# EAGLE board SparkFun RTK Facet - Main (EAGLE 9.6.2)
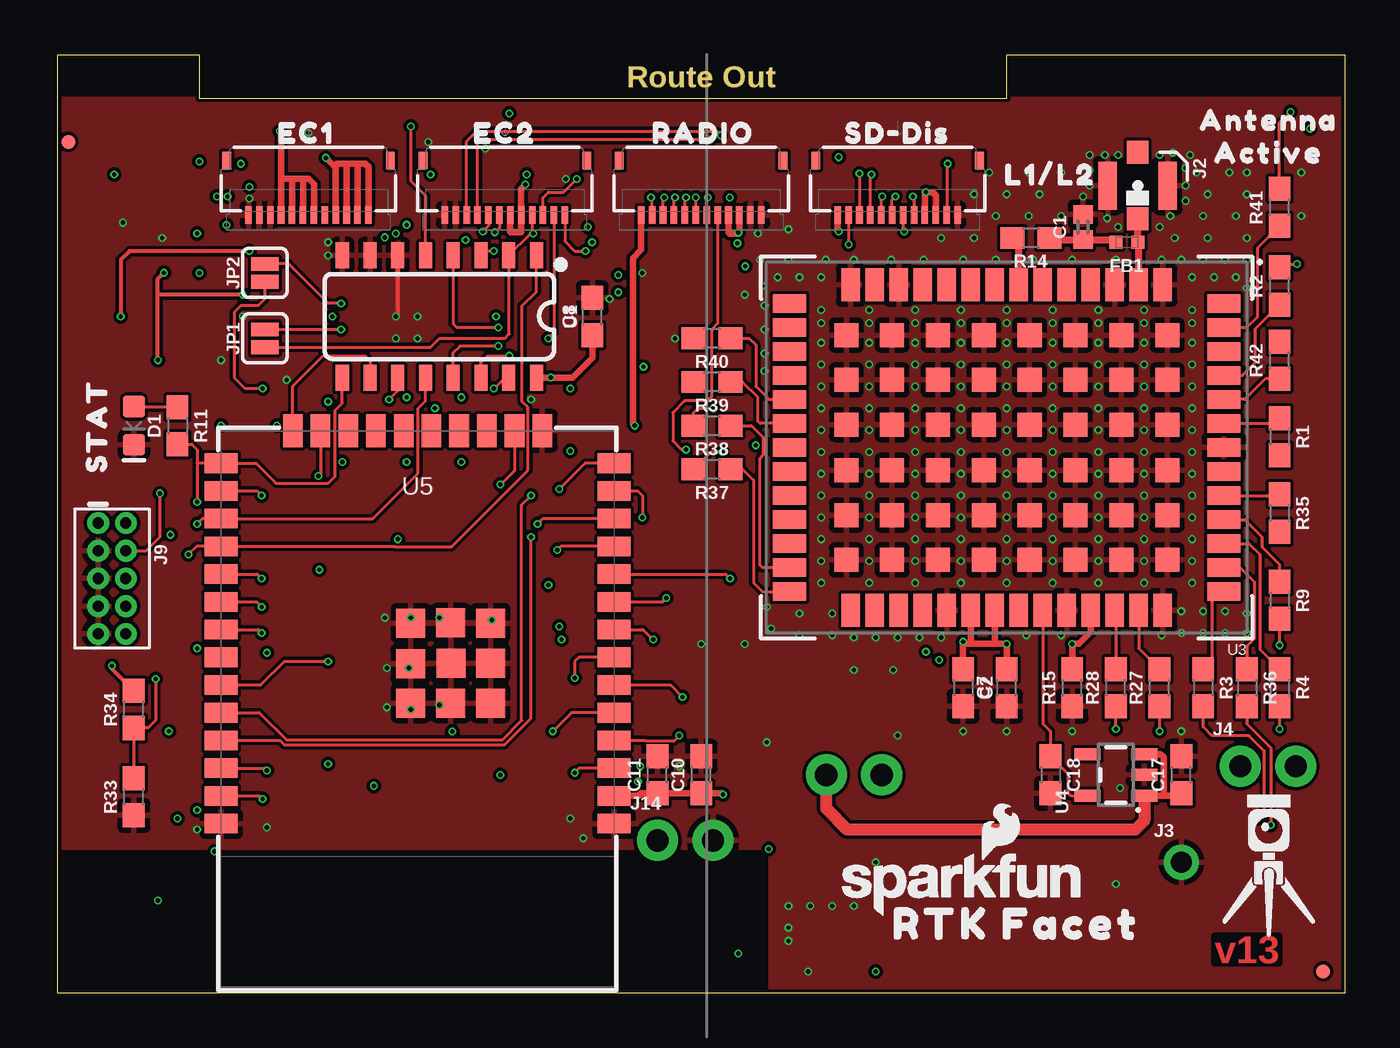
[diagram p2: board, top side]
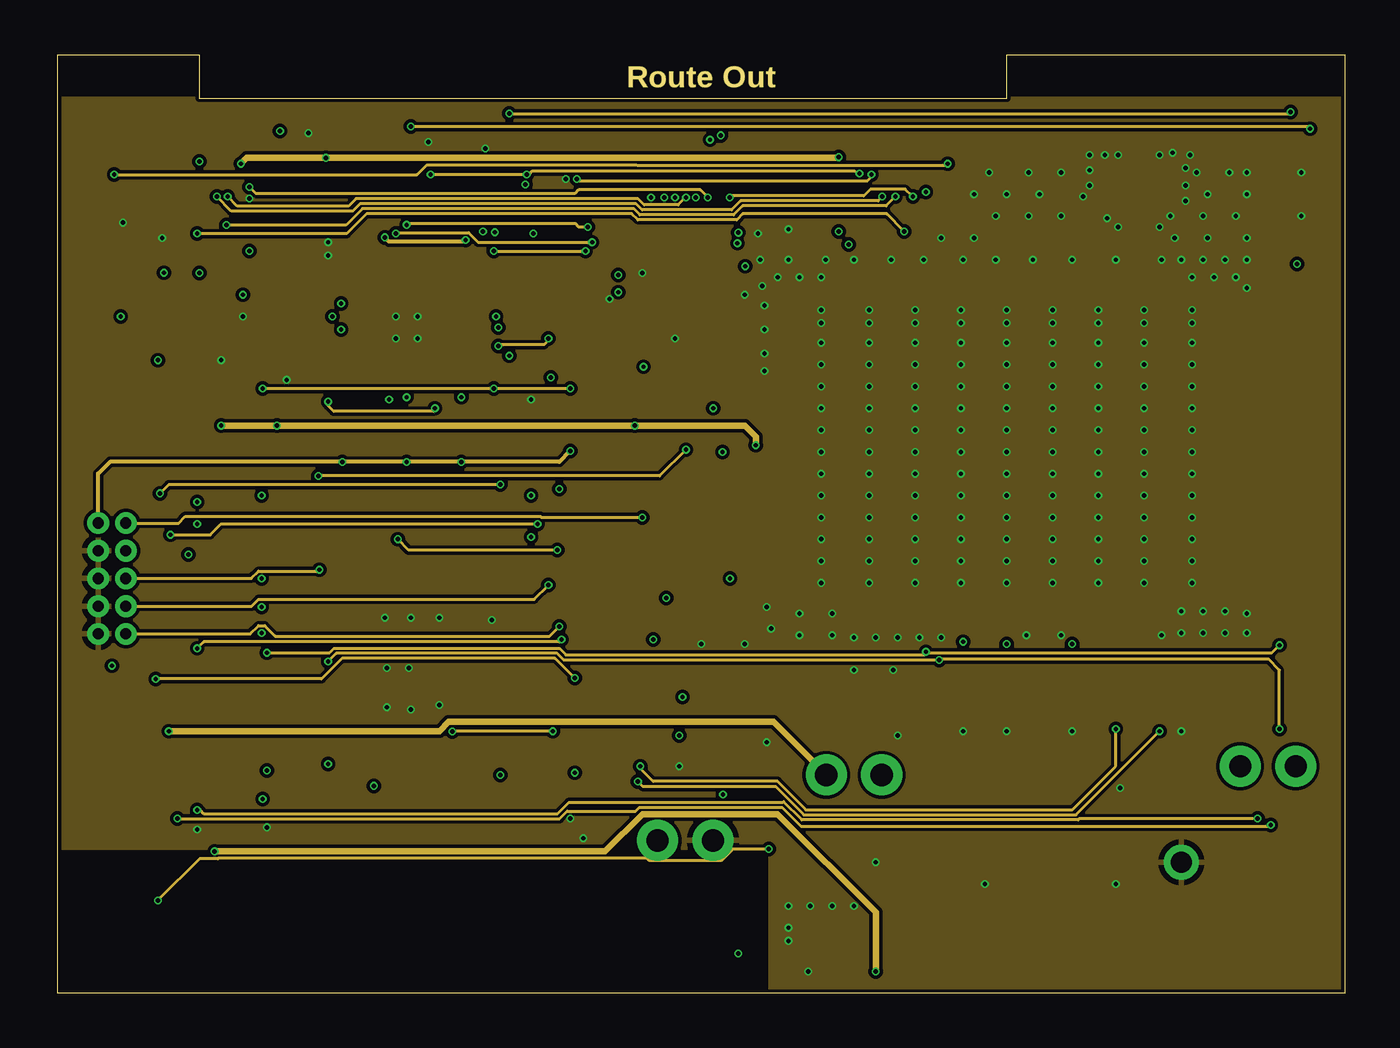
[diagram p3: board, inner layer GND/Horz]
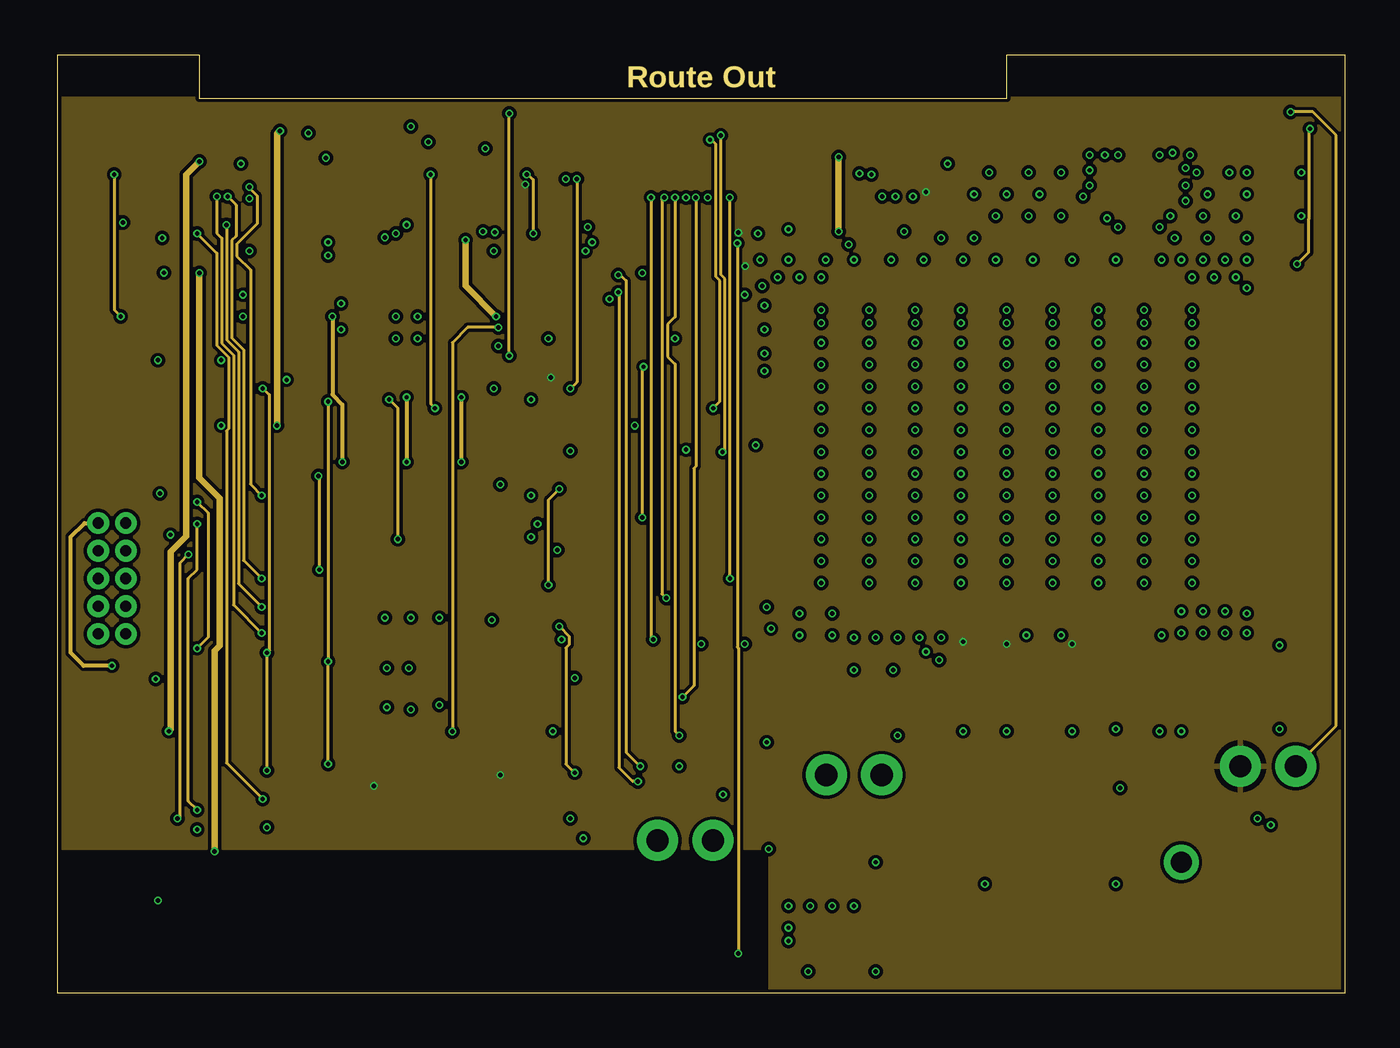
[diagram p4: board, inner layer 3.3V/Vert]
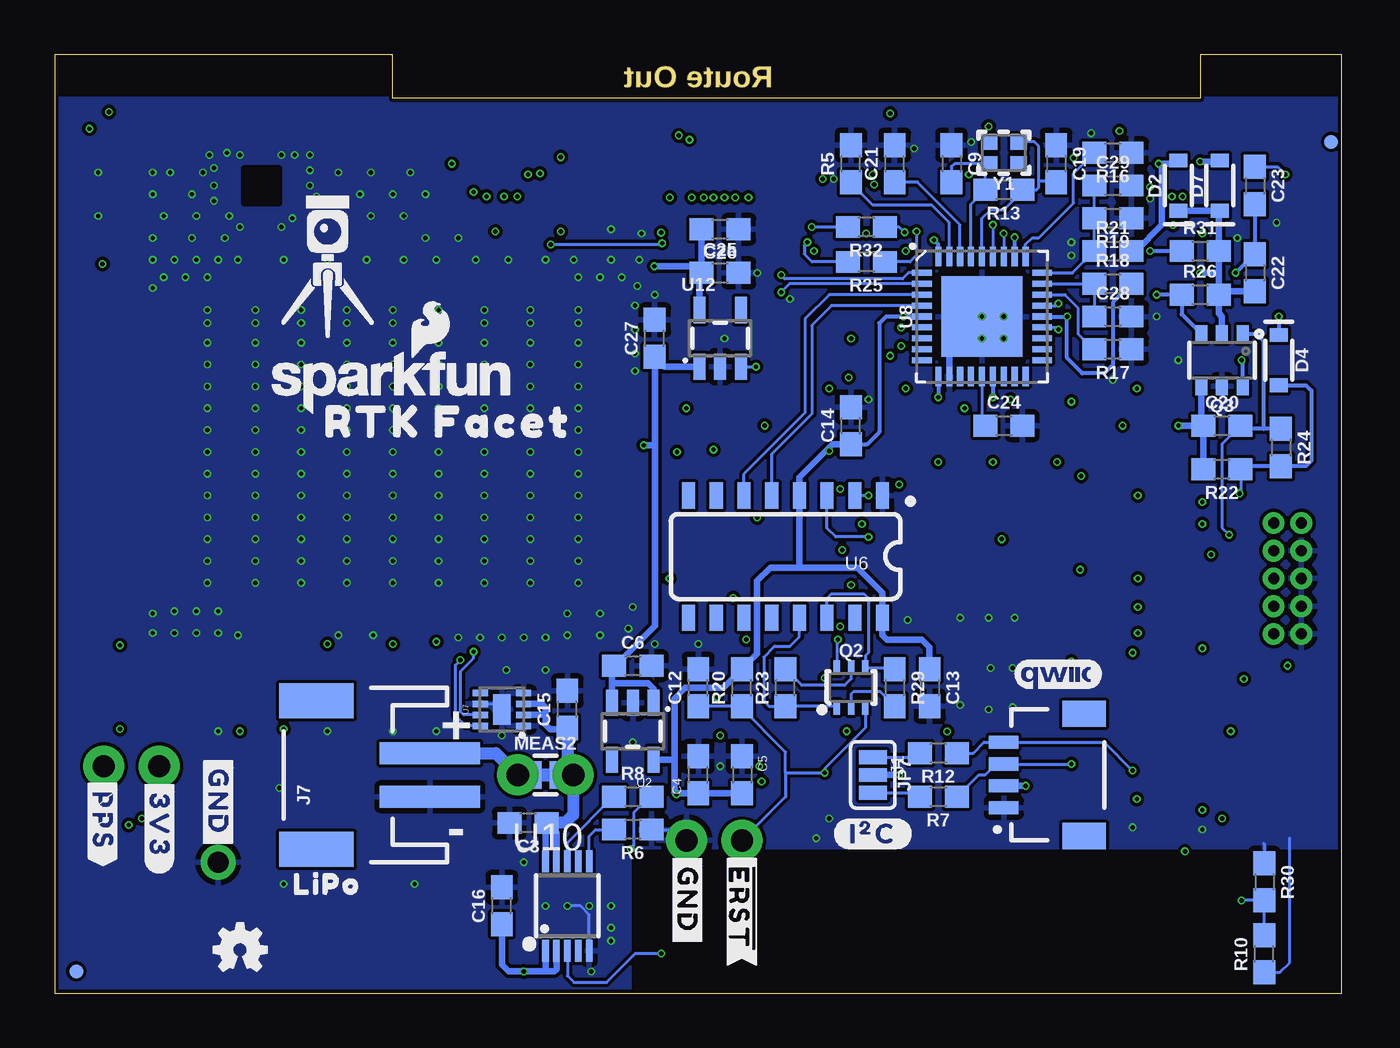
[diagram p5: board, bottom side, seen from below]

Size 59 x 43 mm. Coordinates in mm from the lower left corner, seen from the top.
Outline: 59,43 59,0 0,0 0,43 6.5,43 6.5,41 43.5,41 43.5,43 59,43
Copper layers (1+2*15+16): Top/Horz 0.035mm / dielectric 1.5mm / GND/Horz 0.035mm / dielectric 0.15mm / 3.3V/Vert 0.035mm / dielectric 0.2mm / Bottom/Vert 0.035mm
Design rules "SparkFun-4-Layer-MicroMod-JLCPCB": minimum track width 4mil, minimum drill 0.2mm, track to track 4mil, track to pad 4mil, pad to pad 4mil, via to via 4mil, smd to smd 4mil, copper to edge 6mil, drill to drill 6mil, minimum pad ring 3mil, minimum via ring 3mil, stop-mask expansion 4mil, vias tented up to drill 25mil, thermal gap 10mil
Net classes: 0 default: width 0 mm, drill 0 mm; 1 power: width 0.178 mm; 2 3.3V: width 0.559 mm; 3 RF: width 0.33 mm, clearance 0.203 mm
tKeepout: area 0,0 to 2,43; area 57,0 to 59,43
bKeepout: area 0,0 to 2,43; area 57,0 to 59,43
tRestrict: area 8.9,35.5 to 9.1,35.8; area 9.4,35.5 to 9.6,35.8; area 17.9,35.5 to 18.1,35.8; area 31.9,35.5 to 32.1,35.8; area 9.9,35.5 to 10,35.8; area 18.4,35.5 to 18.6,35.8; area 31.5,35.5 to 31.6,35.8

## Footprints (pad centres in the part's own frame; a part is rotated, then mirrored left to right if it is on the bottom)
0402 = smd 0.85 x 0.9: 1 -0.58,0; 2 0.58,0
0603 = smd 1.1 x 1: 1 -0.85,0; 2 0.85,0
LED-0603 = smd 1 x 1: A -0.877,0; C 0.877,0
SOD-323 = smd 0.63 x 0.83: A 1.15,0; C -1.15,0
0402-TIGHT = smd 0.6 x 0.6: 1 -0.5,0; 2 0.5,0
JST04_1MM_RA = smd 0.6 x 1.35: 1 -1.5,0; 2 -0.5,0; 3 0.5,0; 4 1.5,0 | smd 1.2 x 2: NC1 2.8,-3.675; NC2 -2.8,-3.675
U.FL = smd 2.2 x 0.85: 1 0,1.375; 2 0,-1.375 | smd 1.05 x 1: FEED 1.525,0; NC -1.525,0
1X01_NO_SILK = drill 0.95 pad 1.6: 1 0,0
1X02_NO_SILK = drill 1.016 pad 1.88: 1 0,0; 2 2.54,0
JST-2-SMD = smd 1 x 4.6: 1 -1,-3.7; 2 1,-3.7 | smd 1.6 x 3.4: NC1 -3.4,1.5; NC2 3.4,1.5
FPC_12_DOUBLESIDED_BACKFLIP = smd 0.3 x 0.8: 1 -2.75,1.35; 2 -2.25,1.35; 3 -1.75,1.35; 4 -1.25,1.35; 5 -0.75,1.35; 6 -0.25,1.35; 7 0.25,1.35; 8 0.75,1.35; 9 1.25,1.35; 10 1.75,1.35; 11 2.25,1.35; 12 2.75,1.35 | smd 0.4 x 0.8: MP1 -3.75,-1.15; MP2 3.75,-1.15
2X5-PTH-1.27MM = drill 0.508 pad 1: 1 -2.54,-0.635; 2 -2.54,0.635; 3 -1.27,-0.635; 4 -1.27,0.635; 5 0,-0.635; 6 0,0.635; 7 1.27,-0.635; 8 1.27,0.635; 9 2.54,-0.635; 10 2.54,0.635
SMT-JUMPER_2_NO_SILK = smd 0.635 x 1.27: 1 -0.406,0; 2 0.406,0
SMT-JUMPER_3_NO_SILK = smd 0.635 x 1.27: 1 -0.813,0; 2 0,0; 3 0.813,0
FIDUCIAL-MICRO = smd 0.635 x 0.635: 1 0,0
COMBO-JUMPER_2_NC_TRACE = smd 0.635 x 1.27: 1 -0.508,0; 2 0.508,0 | drill 1.016 pad 1.88: 3 -1.27,0; 4 1.27,0
SC70-6 = smd 0.3 x 0.66: 1 -0.65,-0.92; 2 0,-0.92; 3 0.65,-0.92; 4 0.65,0.92; 5 0,0.92; 6 -0.65,0.92
SOT26 = smd 0.55 x 0.8: D1 -0.95,1.2; D2 0.95,1.2; G1 -0.95,-1.2; G2 0.95,-1.2; S1 0,1.2; S2 0,-1.2
SO16 = smd 0.6 x 1.2: 1 -4.445,-2.8; 2 -3.175,-2.8; 3 -1.905,-2.8; 4 -0.635,-2.8; 5 0.635,-2.8; 6 1.905,-2.8; 7 3.175,-2.8; 8 4.445,-2.8; 9 4.445,2.8; 10 3.175,2.8; 11 1.905,2.8; 12 0.635,2.8; 13 -0.635,2.8; 14 -1.905,2.8; 15 -3.175,2.8; 16 -4.445,2.8
SOT23-5 = smd 0.55 x 1.2: 1 -0.95,-1.3; 2 0,-1.3; 3 0.95,-1.3; 4 0.95,1.3; 5 -0.95,1.3
ZED-F9P = smd 0.85 x 1.52: 1 -7.15,-7.45; 2 -6.05,-7.45; 3 -4.95,-7.45; 4 -3.85,-7.45; 5 -2.75,-7.45; 6 -1.65,-7.45; 7 -0.55,-7.45; 8 0.55,-7.45; 9 1.65,-7.45; 10 2.75,-7.45; 11 3.85,-7.45; 12 4.95,-7.45; 13 6.05,-7.45; 14 7.15,-7.45; 28 7.15,7.45; 29 6.05,7.45; 30 4.95,7.45; 31 3.85,7.45; 32 2.75,7.45; 33 1.65,7.45; 34 0.55,7.45; 35 -0.55,7.45; 36 -1.65,7.45; 37 -2.75,7.45; 38 -3.85,7.45; 39 -4.95,7.45; 40 -6.05,7.45; 41 -7.15,7.45 | smd 1.52 x 0.85: 15 9.95,-6.6; 16 9.95,-5.5; 17 9.95,-4.4; 18 9.95,-3.3; 19 9.95,-2.2; 20 9.95,-1.1; 21 9.95,0; 22 9.95,1.1; 23 9.95,2.2; 24 9.95,3.3; 25 9.95,4.4; 26 9.95,5.5; 27 9.95,6.6; 42 -9.95,6.6; 43 -9.95,5.5; 44 -9.95,4.4; 45 -9.95,3.3; 46 -9.95,2.2; 47 -9.95,1.1; 48 -9.95,0; 49 -9.95,-1.1; 50 -9.95,-2.2; 51 -9.95,-3.3; 52 -9.95,-4.4; 53 -9.95,-5.5; 54 -9.95,-6.6 | smd 1.1 x 1.1: 55 -1.05,-1.05; 56 -3.15,-1.05; 57 -5.25,-1.05; 58 -7.35,-1.05; 59 -1.05,-3.1; 60 -3.15,-3.1; 61 -5.25,-3.1; 62 -7.35,-3.1; 63 -1.05,-5.15; 64 -3.15,-5.15; 65 -5.25,-5.15; 66 -7.35,-5.15; 67 -1.05,5.15; 68 -3.15,5.15; 69 -5.25,5.15; 70 -7.35,5.15; 71 -1.05,3.1; 72 -3.15,3.1; 73 -5.25,3.1; 74 -7.35,3.1; 75 -1.05,1.05; 76 -3.15,1.05; 77 -5.25,1.05; 78 -7.35,1.05; 79 1.05,1.05; 80 3.15,1.05; 81 5.25,1.05; 82 7.35,1.05; 83 1.05,3.1; 84 3.15,3.1; 85 5.25,3.1; 86 7.35,3.1; 87 1.05,5.15; 88 3.15,5.15; 89 5.25,5.15; 90 7.35,5.15; 91 1.05,-5.15; 92 3.15,-5.15; 93 5.25,-5.15; 94 7.35,-5.15; 95 1.05,-3.1; 96 3.15,-3.1; 97 5.25,-3.1; 98 7.35,-3.1; 99 1.05,-1.05; 100 3.15,-1.05; 101 5.25,-1.05; 102 7.35,-1.05
ESP-WROOM-32D-DFM_PASTE = smd 0.9 x 1.5: 1 6.43,9; 2 5.16,9; 3 3.89,9; 4 2.62,9; 5 1.35,9; 6 0.08,9; 7 -1.19,9; 8 -2.46,9; 9 -3.73,9; 10 -5,9; 11 -6.27,9; 12 -7.54,9; 13 -8.81,9; 14 -10.08,9; 25 -10.08,-9; 26 -8.81,-9; 27 -7.54,-9; 28 -6.27,-9; 29 -5,-9; 30 -3.73,-9; 31 -2.46,-9; 32 -1.19,-9; 33 0.08,-9; 34 1.35,-9; 35 2.62,-9; 36 3.89,-9; 37 5.16,-9; 38 6.43,-9 | smd 1.5 x 0.9: 15 -11.57,5.715; 16 -11.57,4.445; 17 -11.57,3.175; 18 -11.57,1.905; 19 -11.57,0.635; 20 -11.57,-0.635; 21 -11.57,-1.905; 22 -11.57,-3.175; 23 -11.57,-4.445; 24 -11.57,-5.715 | smd 1.33 x 1.33: GND -0.912,1.531; GNDT1 -2.751,3.346; GNDT2 -2.761,1.516; GNDT3 -2.751,-0.314; GNDT4 -0.891,-0.324; GNDT5 0.909,-0.314; GNDT6 0.909,1.516; GNDT7 0.909,3.346; GNDT8 -0.921,3.346
SO016 = smd 0.6 x 1.2: 1 -4.445,-2.8; 2 -3.175,-2.8; 3 -1.905,-2.8; 4 -0.635,-2.8; 5 0.635,-2.8; 6 1.905,-2.8; 7 3.175,-2.8; 8 4.445,-2.8; 9 4.445,2.8; 10 3.175,2.8; 11 1.905,2.8; 12 0.635,2.8; 13 -0.635,2.8; 14 -1.905,2.8; 15 -3.175,2.8; 16 -4.445,2.8
DFN-8 = smd 0.3 x 0.7: 1 -0.75,-0.99; 2 -0.25,-0.99; 3 0.25,-0.99; 4 0.75,-0.99; 5 0.75,0.99; 6 0.25,0.99; 7 -0.25,0.99; 8 -0.75,0.99 | smd 1.38 x 0.8: 9 0,0
QFN-36 = smd 0.9 x 0.28: 1 -2.75,2; 2 -2.75,1.5; 3 -2.75,1; 4 -2.75,0.5; 5 -2.75,0; 6 -2.75,-0.5; 7 -2.75,-1; 8 -2.75,-1.5; 9 -2.75,-2; 19 2.75,-2; 20 2.75,-1.5; 21 2.75,-1; 22 2.75,-0.5; 23 2.75,0; 24 2.75,0.5; 25 2.75,1; 26 2.75,1.5; 27 2.75,2 | smd 0.28 x 0.9: 10 -2,-2.75; 11 -1.5,-2.75; 12 -1,-2.75; 13 -0.5,-2.75; 14 0,-2.75; 15 0.5,-2.75; 16 1,-2.75; 17 1.5,-2.75; 18 2,-2.75; 28 2,2.75; 29 1.5,2.75; 30 1,2.75; 31 0.5,2.75; 32 0,2.75; 33 -0.5,2.75; 34 -1,2.75; 35 -1.5,2.75; 36 -2,2.75 | smd 3.7 x 3.7: EP 0,0
MSOP10 = smd 0.3 x 1: 1 -1,-2.05; 2 -0.5,-2.05; 3 0,-2.05; 4 0.5,-2.05; 5 1,-2.05; 6 1,2.05; 7 0.5,2.05; 8 0,2.05; 9 -0.5,2.05; 10 -1,2.05
CRYSTAL-SMD-2.0X1.6MM = smd 0.75 x 0.7: 1 -0.675,-0.5; 2 0.675,-0.5; 3 0.675,0.5; 4 -0.675,0.5

## Placement (x,y rotation side)
C1  47pF  [0402]  47,35.1 90 top
C2  1.0uF  [0603]  41.5,14 270 top
C3  4.7uF  [0603]  37.3,7.8 180 bottom
C4  1.0uF  [0603]  29.5,10 90 bottom
C5  0.1uF  [0603]  27.5,10 270 bottom
C6  1.0uF  [0603]  32.5,15 0 bottom
C7  0.1uF  [0603]  43.5,14 90 top
C8  0.1uF  [0603]  24.51,31 90 top
C9  18pF  [0603]  17.9,38 270 bottom
C10  10uF  [0603]  29.5,10 90 top
C11  0.1uF  [0603]  27.5,10 90 top
C12  0.1uF  [0603]  29.5,14 90 bottom
C13  0.1uF  [0603]  18.9,14 270 bottom
C14  10uF  [0603]  22.5,26 90 bottom
C15  0.1uF  [0603]  35.5,13 90 bottom
C16  4.7uF  [0603]  38.5,4 90 bottom
C17  1.0uF  [0603]  51.5,10 90 top
C18  1.0uF  [0603]  45.5,10 270 top
C19  18pF  [0603]  13.1,38 270 bottom
C20  10uF  [0603]  5.5,26 0 bottom
C21  0.1uF  [0603]  20.5,38 90 bottom
C22  0.1uF  [0603]  4,33 270 bottom
C23  0.1uF  [0603]  4,37 270 bottom
C24  0.1uF  [0603]  15.5,26 0 bottom
C25  1.0uF  [0603]  28.5,33 0 bottom
C26  0.1uF  [0603]  28.5,35 180 bottom
C27  1.0uF  [0603]  31.5,30 90 bottom
C28  0.1uF  [0603]  10.5,31 0 bottom
C29  0.1uF  [0603]  10.5,37 0 bottom
D1  Yellow  [LED-0603]  3.5,26 270 top
D2  3A/10V/280mV  [SOD-323]  7.5,37 90 bottom
D4  250mA/100V  [SOD-323]  2.9,29 270 bottom
D7  3A/10V/280mV  [SOD-323]  5.6,37 90 bottom
FB1  2.66Ω  [0402-TIGHT]  49,34.4 180 top
FRAME1  FRAME-LEDGER  [CREATIVE_COMMONS]  82.55,6.35 0 top  (outside the outline)
FRAME2  FRAME-LEDGER  [CREATIVE_COMMONS]  82.55,6.35 0 top  (outside the outline)
J1  QWIIC_RIGHT_ANGLE  [JST04_1MM_RA]  15.5,10 90 bottom
J2  U.FL  [U.FL]  49.5,37 270 top
J3  [1X01_NO_SILK]  51.5,6 0 top
J4  [1X02_NO_SILK]  54.2,10.4 0 top
J7  [JST-2-SMD]  45.5,10 90 bottom
J8  [FPC_12_DOUBLESIDED_BACKFLIP]  38.5,37 180 top
J9  CORTEX_JTAG_DEBUG_PTH  [2X5-PTH-1.27MM]  2.5,19 270 top
J10  [FPC_12_DOUBLESIDED_BACKFLIP]  29.5,37 180 top
J14  [1X02_NO_SILK]  27.5,7 0 top
J15  [FPC_12_DOUBLESIDED_BACKFLIP]  11.5,37 180 top
J18  [FPC_12_DOUBLESIDED_BACKFLIP]  20.5,37 180 top
JP1  JUMPER-SMT_2_NO_SILK  [SMT-JUMPER_2_NO_SILK]  9.5,30 90 top
JP2  JUMPER-SMT_2_NO_SILK  [SMT-JUMPER_2_NO_SILK]  9.5,33 90 top
JP7  JUMPER-SMT_3_NO_SILK  [SMT-JUMPER_3_NO_SILK]  21.5,10 270 bottom
JP21  FIDUCIALUFIDUCIAL  [FIDUCIAL-MICRO]  58,1 0 top
JP61  FIDUCIALUFIDUCIAL  [FIDUCIAL-MICRO]  0.5,39 0 top
JP71  FIDUCIALUFIDUCIAL  [FIDUCIAL-MICRO]  58,1 0 bottom
JP81  FIDUCIALUFIDUCIAL  [FIDUCIAL-MICRO]  0.5,39 0 bottom
LOGO1  OSHW-LOGOMINI  [OSHW-LOGO-MINI]  50.5,2 0 bottom
LOGO2  SFE_LOGO_NAME_FLAME.1_INCH  [SFE_LOGO_NAME_FLAME_.1]  41.5,5 0 top
LOGO3  SFE_LOGO_NAME_FLAME.1_INCH  [SFE_LOGO_NAME_FLAME_.1]  43.5,28 0 bottom
MEAS2  JUMPER-COMBO_2_NC_TRACE  [COMBO-JUMPER_2_NC_TRACE]  36.5,10 0 bottom
Q2  MBT3904DW1T1  [SC70-6]  22.5,14 0 bottom
Q3  SIL2308  [SOT26]  5.5,29 180 bottom
R1  33  [0603]  56,25.5 270 top
R2  33  [0603]  56,32.4 90 top
R3  33  [0603]  52.5,14 270 top
R4  33  [0603]  56,14 270 top
R5  12k  [0603]  22.5,38 90 bottom
R6  1k  [0603]  32.5,7.5 180 bottom
R7  2.2k  [0603]  18.5,9 180 bottom
R8  0  [0603]  32.5,9 0 bottom
R9  33  [0603]  56,18 270 top
R10  10k  [0603]  3.56,1.8 90 bottom
R11  1k  [0603]  5.5,26 270 top
R12  2.2k  [0603]  18.5,11 180 bottom
R13  1M  [0603]  15.5,36.8 180 bottom
R14  10  [0603]  44.6,34.6 180 top
R15  100k  [0603]  46.5,14 90 top
R16  100k  [0603]  10.5,38.5 180 bottom
R17  100k  [0603]  10.5,29.5 180 bottom
R18  100k  [0603]  10.5,32.5 0 bottom
R19  100k  [0603]  10.5,35.5 180 bottom
R20  10k  [0603]  27.5,14 90 bottom
R21  100k  [0603]  10.5,34 0 bottom
R22  10k  [0603]  5.5,24 180 bottom
R23  10k  [0603]  25.5,14 90 bottom
R24  300k  [0603]  2.8,25 270 bottom
R25  22Ω  [0603]  21.8,33.5 180 bottom
R26  100k  [0603]  6.5,32 0 bottom
R27  27  [0603]  50.5,14 90 top
R28  27  [0603]  48.5,14 90 top
R29  10k  [0603]  20.5,14 270 bottom
R30  150k  [0603]  3.56,5.1 270 bottom
R31  10k  [0603]  6.5,34 0 bottom
R32  22Ω  [0603]  21.8,35.1 180 bottom
R33  10k  [0603]  3.5,9 90 top
R34  10k  [0603]  3.5,13 90 top
R35  33  [0603]  56,22 270 top
R36  33  [0603]  54.5,14 270 top
R37  33  [0603]  30,24 180 top
R38  33  [0603]  30,26 180 top
R39  33  [0603]  30,28 180 top
R40  33  [0603]  30,30 180 top
R41  33  [0603]  56,36 90 top
R42  33  [0603]  56,29 90 top
U1  74HC4052D  [SO16]  17.5,31 180 top
U2  AP2112K-3.3V  [SOT23-5]  32.5,12 180 bottom
U3  U-BLOX_ZED-F9P  [ZED-F9P]  43.5,25 180 top
U4  STLQ015  [SOT23-5]  48.5,10 90 top
U5  ESP-WROOM-3232D-DFMP  [ESP-WROOM-32D-DFM_PASTE]  16.5,14.2 270 top
U6  CH340C  [SO016]  25.5,20 180 bottom
U7  MAX17048  [DFN-8]  38.5,13 90 bottom
U8  USB251XB  [QFN-36]  16.5,31 0 bottom
U10  MCP73833MSOP  [MSOP10]  35.5,4 0 bottom
U12  AP2112K-3.3V  [SOT23-5]  28.5,30 0 bottom
U$1  [LIPO0]  46.5,5 0 bottom
U$2  SPECIAL_INSTRUCTIONS-ORDERING  [ORDERING_INSTRUCTIONS]  62.54,81.28 0 top  (outside the outline)
U$3  [EC21]  20.5,39.4 0 top
U$4  [SD#DIS0]  38.5,39.4 0 top
U$5  [ACTIVE1]  55.5,38.5 0 top
U$6  [#3V3#0]  54.2,7.7 270 bottom
U$7  [ANTENNA2]  55.5,40 0 top
U$8  [EC10]  11.4,39.4 0 top
U$9  [L1#L20]  45.5,37.5 0 top
U$10  [#PPS#1]  56.8,7.9 270 bottom
U$11  [RTK_FACET0]  43.95,3.17 0 top
U$12  [RADIO0]  29.6,39.4 0 top
U$13  [RTK_FACET0]  40.95,26.18 0 bottom
U$14  [#GND#1]  51.5,11 270 bottom
U$15  [RTK5#SVG0]  55.51,5.84 0 top
U$16  [RTK5#SVG0]  46.49,33.27 0 bottom
U$24  [STAT0]  1.8,26 90 top
U$25  [#I�C#0]  21.5,7.3 0 bottom
U$26  [##ERST##0]  27.5,3.9 270 bottom
U$30  [QWIIC_4MM]  13,14.6 0 bottom
U$84  [#GND#1]  30,6.5 270 bottom
Y1  24MHz  [CRYSTAL-SMD-2.0X1.6MM]  15.5,38.5 180 bottom

## Tracks (layer width: path | path; a pad name or v marks a point on that pad's centre or on a via)
3.3V  (via drill 0.2)
  Top/Horz 0.305: U1.16 v22.6,28.2 23.6,28.2 24.51,29.11 C8.1 | C2.1 v41.5,16.1 41.6,16 41.9,16 | C7.2 v43.5,16 43,16 | 41.9,16 43,16 | 41.9,16 41.85,16.05 U3.33 | 43,16 42.95,16.05 U3.34 | U3.38 47.35,16.55 46.8,16 v46.5,16 R15.2 | v21.44,37.04 21.25,36.85 J18.5 21.25,34.87 20.77,34.87 20.75,34.89 J18.6 | J8.4 39.75,36.65 v39.8,36.7 40.1,36.7 40.25,36.55 J8.3 | J10.4 30.75,34.85 30.8,34.8 31.16,34.8 v31.2,34.84 31.21,34.85 31.25,34.85 J10.3
  Bottom/Vert 0.305: C26.2 29.35,33.3 | 29.35,33.3 C25.1 29.45,32.9 U12.5 | v31.52,33.3 29.35,33.3 | J1.2 v14.5,9.5 | JP7.2 v20.3,10
  pour 3.3V/Vert (isolate 0.152, rank 4): 0,41 59,41 59,0 0,0
ANT_VCC
  Top/Horz 0.305: R14.1 45.53,34.52 | 48.38,34.52 FB1.2
  Top/Horz 0.33: 45.53,34.52 C1.1 48.38,34.52
CHG_LED  (via drill 0.2)
  Top/Horz 0.127: v36.25,34.3 J8.11
  3.3V/Vert 0.127: v31.2,1.82 31.2,15.82 31.16,15.86 v31.16,34.36
  Bottom/Vert 0.127: v31.16,34.36 31.22,34.3 v36.25,34.3 | U10.3 35.5,0.8 35.2,0.5 33.7,0.5 32.38,1.82 v31.2,1.82
CHG_THERM1  (via drill 0.2)
  GND/Horz 0.127: v32.6,6.6 30.95,6.6 30.42,6.07 27.12,6.07 27.01,6.18 7.37,6.18 7.34,6.16 6.51,6.16 v4.6,4.25
  Bottom/Vert 0.127: R10.2 R30.2 v4.6,4.25 | v32.6,6.6 32.47,6.74 32.47,8.27 31.73,9 R8.2
ESP32_!DTR
  Bottom/Vert 0.127: Q2.1 23.22,13.15 R23.1 26.25,13.15 26.5,13.4 26.5,15.4 26,15.9 25.3,15.9 24.86,16.34 U6.13
ESP32_!RTS
  Bottom/Vert 0.127: R29.1 20.57,14.92 Q2.4 21.85,15.46 21.7,15.61 21.7,18.1 21.9,18.3 23.4,18.3 23.59,18.11 U6.14
ESP32_EN  (via drill 0.2)
  Top/Horz 0.127: U5.3 23.91,10.31 v23.7,10.1
  GND/Horz 0.127: J9.10 8.84,16.46 9.22,16.84 9.5,16.84 9.98,16.36 22.56,16.36 v23,16.8
  3.3V/Vert 0.127: v23,16.8 23.44,16.36 23.44,15.96 23.3,15.82 23.3,10.5 v23.7,10.1
  Bottom/Vert 0.127: R20.1 27.6,13.15 | 27.6,13.15 C12.1 | 27.6,13.15 25.5,11.05 25.5,10.1 | 25.5,10.1 v23.7,10.1 23.7,10.3 21.85,12.15 Q2.3 | 25.5,10.1 25.5,9 J14.1
ESP32_RXI  (via drill 0.2)
  Top/Horz 0.127: v21.7,22.8 21.27,22.37 21.27,12.49 20.39,11.61 10.49,11.61 9.25,12.85 U5.34
  Bottom/Vert 0.127: v21.7,22.8 U6.2
ESP32_TXO  (via drill 0.2)
  Top/Horz 0.127: v21.7,20.9 21.7,12.6 20.48,11.38 10.4,11.38 10.2,11.58 U5.35
  Bottom/Vert 0.127: v21.7,20.9 23.2,20.9 23.59,21.3 U6.3
ESP_0/BOOT/STAT_LED/MUX_B  (via drill 0.2)
  Top/Horz 0.127: U1.9 13.05,27.03 12.71,26.69 12.71,23.67 12.4,23.36 10.02,23.36 9.1,24.28 U5.25 6.42,24.28 6.4,24.3 | R11.2 6.15,25.15 6.4,24.9 6.4,24.3 | 6.4,24.3 v6.4,22.5
  GND/Horz 0.127: v23.1,16.2 23,16.1 6.7,16.1 v6.4,15.8
  3.3V/Vert 0.127: v6.4,22.5 6.9,22 6.9,16.3 v6.4,15.8
  Bottom/Vert 0.127: v23.1,16.2 23.15,16.15 Q2.6
ESP_2/MUX_A
  Top/Horz 0.127: U5.24 10.79,27.8 12.18,29.2 14.1,29.2 14.32,28.98 U1.10
ESP_3V3  (via drill 0.2)
  Top/Horz 0.178: R34.2 2.5,14.85 v2.5,15
  Top/Horz 0.305: v30.5,9.1 30.45,9.15 C10.1 C11.1 26.75,9.15 26.64,9.04 U5.2
  GND/Horz 0.178: J9.1 1.86,23.8 2.41,24.34 v13.05,24.34 v16,24.34 v18.5,24.34 23,24.34 v23.5,24.84 | v18.7,34.5 18.7,34.48 18.65,34.43 15.19,34.43 v15,34.63
  3.3V/Vert 0.178: v12.6,31 12.6,27.42 13.05,26.97 v13.05,24.34 | v16,27.3 v16,24.34 | v18.5,27.3 v18.5,24.34 | v2.5,15 1.2,15 0.6,15.6 0.6,20.9 1.24,21.54 J9.1
  3.3V/Vert 0.305: v18.7,34.5 18.7,32.4 v20.1,31
  Bottom/Vert 0.178: U8.10 v18.5,27.3 | C14.1 21.75,25.15 21.2,25.7 21.2,30.7 20.9,31 v20.1,31 U8.5 | U8.36 18.5,34.3 v18.7,34.5 | U8.29 v15,34.63 | U8.23 v12.6,31 12.6,29.1 11.9,28.4 10.9,28.4 10.5,28.8 10.5,31.65 R18.2 | U8.15 v16,27.3
  Bottom/Vert 0.305: 30.6,10.7 30.6,13.5 30.1,14 28.35,14 R20.2 26.8,15.55 26.8,18.9 26.2,19.5 24.9,19.5 | 30.6,10.7 30.6,9.2 v30.5,9.1 30.45,9.15 C10.1 C11.1 | U2.5 30.6,10.7 | 30.6,10.7 | C13.1 18.9,15.85 19.25,16.2 20.86,16.2 21.05,16.4 U6.16 21.05,18.34 21.05,18.35 22.2,19.5 24.9,19.5 | 24.9,19.5 24.86,19.54 U6.4 24.86,23.64 23.6,24.9 | C14.1 23.35,25.15 23.6,24.9 | v23.5,24.84 23.56,24.9 23.6,24.9
ESP_4/RADIO_PWR_ON  (via drill 0.2)
  Top/Horz 0.127: J10.6 29.75,36.41 v29.8,36.46 | U5.26 9.15,23.01 v9.36,22.8
  GND/Horz 0.127: v29.8,36.46 29.46,36.8 23.88,36.8 23.71,36.63 9.1,36.63 v8.8,36.93
  3.3V/Vert 0.127: v8.8,36.93 8.8,36.88 9.14,36.54 9.14,35.24 8.21,34.31 8.21,33.77 8.84,33.14 8.84,23.32 v9.36,22.8
ESP_5/RADIO_CTSI  (via drill 0.2)
  Top/Horz 0.127: J10.8 28.75,36.41 v28.8,36.46 | U5.29 9.16,19.2 v9.36,19
  GND/Horz 0.127: v7.8,36.5 8.24,36.06 13.34,36.06 13.68,36.4 26.6,36.4 26.88,36.12 28.44,36.12 28.78,36.46 v28.8,36.46
  3.3V/Vert 0.127: v7.8,36.5 8.19,36.11 8.19,34.69 7.99,34.49 7.99,30.02 8.53,29.48 8.53,19.83 v9.36,19
ESP_12/MTDI  (via drill 0.2)
  Top/Horz 0.127: U5.14 24.18,24.28 v23,23.1
  GND/Horz 0.127: J9.8 8.91,17.73 9.22,18.04 21.84,18.04 v22.5,18.7
  3.3V/Vert 0.127: v22.5,18.7 22.5,22.6 v23,23.1
ESP_13/POWER_CTRL/MTCK  (via drill 0.2)
  Top/Horz 0.127: J9.4 4.07,20.27 4.7,20.9 v4.7,22.9 | U5.16 20.95,23.95 v20.3,23.3
  GND/Horz 0.127: v20.3,23.3 5.1,23.3 v4.7,22.9
  Bottom/Vert 0.127: v4.7,22.9 4.62,22.98 4.62,24.02
  Bottom/Vert 0.178: D4.A 1.65,27.85 1.4,27.6 1.4,24.4 1.65,24.15 R24.2 4.5,24.15 4.62,24.02 R22.1
ESP_14/PERIPHERAL_POWER/MTMS  (via drill 0.2)
  Top/Horz 0.127: U5.13 26.59,23.01 26.8,22.8 v26.8,21.8
  GND/Horz 0.127: J9.2 5.56,21.54 5.86,21.84 22.14,21.84 22.18,21.8 v26.8,21.8
  3.3V/Vert 0.127: v26.8,21.8 26.8,28.64 v26.86,28.7
  Bottom/Vert 0.127: U12.3 v26.86,28.7 26.8,28.7
ESP_15/MTDO/RADIO_!RESET!  (via drill 0.2)
  Top/Horz 0.127: J10.5 30.25,30.68 29.96,30.4 29.96,27.33 29.77,27.14 28.73,27.14 28.2,26.6 28.2,25.3 28.6,24.9 v28.8,24.9 | U5.23 12.05,23.8 v11.96,23.7
  GND/Horz 0.127: v28.8,24.9 27.6,23.7 v11.96,23.7 | J9.6 8.88,19 9.22,19.34 11.94,19.34 v12,19.4
  3.3V/Vert 0.127: v11.96,23.7 12,23.66 v12,19.4
ESP_16/ZED-TXO1  (via drill 0.2)
  Top/Horz 0.127: U1.12 16.86,27.13 16.52,26.79 16.52,23.82 14.44,21.74 U5.27 6.64,21.74 v6.4,21.5 | v55,8 55.06,8 55.3,8.24 55.3,11.1 54.6,11.8 52.9,11.8 52.5,12.2 R3.2
  GND/Horz 0.127: v55,8 46.82,8 46.77,7.94 34.11,7.94 33.27,8.78 33.25,8.75 23.44,8.75 22.92,8.23 6.7,8.23 6.53,8.4 v6.4,8.4
  3.3V/Vert 0.127: v6.4,21.5 6.4,19.4 6,19 6,8.8 v6.4,8.4
ESP_17/ZED-RXI1  (via drill 0.2)
  Top/Horz 0.127: U1.1 21.95,32.15 21.3,31.5 21.3,27.1 21.56,26.84 21.56,23.96 18.06,20.46 15.46,20.46 15.45,20.47 U5.28 6.37,20.47 v6,20.1 | R36.2 54.5,12.35 55.6,11.25 v55.6,7.7
  GND/Horz 0.127: v55.6,7.7 55.56,7.66 34.07,7.66 33.21,8.52 26.67,8.52 26.49,8.34 23.36,8.34 23.02,8 v5.5,8
  3.3V/Vert 0.127: v6,20.1 5.6,19.7 5.6,8.1 v5.5,8
ESP_18/SD_SCK  (via drill 0.2)
  Top/Horz 0.127: J8.7 38.25,36.35 v38.4,36.5 | U5.30 9.13,17.93 v9.36,17.7
  GND/Horz 0.127: v38.4,36.5 37.97,36.07 31.39,36.07 30.98,35.66 26.69,35.66 26.41,35.94 13.97,35.94 13.22,35.19 v7.74,35.19
  3.3V/Vert 0.127: v9.36,17.7 8.3,18.76 8.3,29.38 7.76,29.93 7.76,35.17 v7.74,35.19
ESP_19/SD_CIPO  (via drill 0.2)
  Top/Horz 0.127: J8.8 37.75,36.45 v37.8,36.5 | U5.31 9.2,16.66 v9.36,16.5
  GND/Horz 0.127: v37.8,36.5 37.6,36.3 31.3,36.3 30.89,35.89 26.79,35.89 26.5,36.17 13.88,36.17 13.54,35.83 7.97,35.83 v7.3,36.5
  3.3V/Vert 0.127: v7.3,36.5 7.3,34.82 7.53,34.59 7.53,29.78 8.07,29.24 8.07,17.79 v9.36,16.5
ESP_21/SDA  (via drill 0.2)
  Top/Horz 0.127: v36.75,37.55 J8.10 | JP1.1 17.09,29.59 17.5,30 20.5,30 20.7,30.2 20.7,33.8 U1.2 21.68,34.8 v21.8,34.8 21.75,34.85 J18.4 | v12.4,15.2 10.4,15.2 9.32,14.12 U5.33 | R4.2 v56,12.1
  GND/Horz 0.127: v17.3,26.8 17.3,26.72 17.24,26.66 12.66,26.66 12.4,26.92 v12.4,27.1 | v17.1,37.5 v21.5,37.5 21.6,37.5 21.76,37.66 36.54,37.66 36.65,37.55 v36.75,37.55 | v12.4,15.2 12.77,15.57 22.89,15.57 23.21,15.26 v40.4,15.26 40.36,15.3 55.5,15.3 56,14.8 v56,12.1
  3.3V/Vert 0.127: v17.1,37.5 17.1,27 v17.3,26.8 | v12.4,27.1 v12.4,15.2 v12.4,10.5 | v21.5,37.5 21.57,37.5 21.8,37.27 v21.8,34.8
  Bottom/Vert 0.127: U7.8 40.17,12.25 40.63,12.71 40.63,15.03 v40.4,15.26 | v12.4,10.5 J1.3 15.85,10.5 16.35,10 16.65,10 R7.1
ESP_22/SCL  (via drill 0.2)
  Top/Horz 0.127: J8.9 37.25,37.45 v37.3,37.5 | J18.3 22.25,36.45 22.5,36.7 23.2,36.7 v23.8,37.3 | JP2.1 9.5,31.8 9.2,31.5 8.4,31.5 8.1,31.2 8.1,28.2 8.6,27.7 v9.4,27.7 | U1.15 20.5,28.2 v20,27.7 | U5.36 9.49,10.31 v9.6,10.2 | R9.2 v56,15.94
  GND/Horz 0.127: 39.84,15.6 v39.8,15.64 | v37.3,37.5 37.3,37.4 37.1,37.2 23.9,37.2 v23.8,37.3 | v23.5,27.7 v20,27.7 v9.4,27.7 | v9.6,15.6 12.48,15.6 12.68,15.8 23,15.8 23.3,15.5 39.74,15.5 39.84,15.6 | v56,15.94 55.66,15.6 39.84,15.6
  3.3V/Vert 0.127: v9.6,10.2 v9.6,15.6 9.7,15.7 9.7,27.42 9.42,27.7 v9.4,27.7 | v23.8,37.3 23.8,28 v23.5,27.7
  Bottom/Vert 0.127: U7.7 40.25,12.75 40.4,12.9 40.4,14.74 39.8,15.34 v39.8,15.64 | v9.6,10.2 10.9,11.5 J1.4 16.4,11.5 16.9,11 R12.1
ESP_23/SD_COPI  (via drill 0.2)
  Top/Horz 0.127: J8.6 38.75,34.95 v38.8,34.9 | U5.37 9.26,9.04 v9.4,8.9
  GND/Horz 0.127: v38.8,34.9 38,35.7 31.4,35.7 31.13,35.43 26.6,35.43 26.32,35.71 14.17,35.71 13.25,34.8 v6.4,34.8
  3.3V/Vert 0.127: v6.4,34.8 7.3,33.9 7.3,29.68 7.84,29.14 7.84,25.86 7.75,25.77 7.75,10.55 v9.4,8.9
ESP_25/SD_!CS!  (via drill 0.2)
  Top/Horz 0.127: v39.2,36.5 39.25,36.45 J8.5 | U5.10 30.62,19.2 v30.82,19
  GND/Horz 0.127: v39.2,36.5 39.18,36.5 38.84,36.84 37.26,36.84 36.95,36.53 30.87,36.53 v30.8,36.46
  3.3V/Vert 0.127: v30.8,36.46 30.82,36.44 v30.82,19
ESP_26/DAC2  (via drill 0.2)
  Top/Horz 0.127: v15.2,27.2 15.6,27.59 U1.11 | U5.11 23.07,20.47 v22.9,20.3
  GND/Horz 0.127: v22.9,20.3 16.1,20.3 v15.6,20.8
  3.3V/Vert 0.127: v15.6,20.8 15.6,26.8 v15.2,27.2
ESP_27/FAST_OFF  (via drill 0.2)
  Top/Horz 0.127: U5.12 22.24,21.74 v22,21.5
  GND/Horz 0.127: v22,21.5 7.5,21.5 7,21 v5.17,21
  Bottom/Vert 0.127: C20.2 5.5,25.15 5.5,21.33 v5.17,21
  Bottom/Vert 0.178: Q3.G1 3.9,30.2 3.6,29.9 3.6,25.85 | R24.1 3.6,25.85 | 3.6,25.85 4.5,25.85 C20.2
ESP_32/RADIO_TXO  (via drill 0.2)
  Top/Horz 0.127: J10.11 27.25,36.41 v27.2,36.46 | U5.8 26.84,16.66 v27.3,16.2
  3.3V/Vert 0.127: v27.3,16.2 27.22,16.28 27.2,16.28 v27.2,36.46
ESP_33/RADIO_RXI  (via drill 0.2)
  Top/Horz 0.127: J10.10 27.75,36.41 v27.8,36.46 | U5.9 27.73,17.93 v27.9,18.1
  3.3V/Vert 0.127: v27.8,36.46 27.7,36.36 27.7,18.3 v27.9,18.1
ESP_DM
  Bottom/Vert 0.127: U8.3 23.5,32 24.6,30.9 24.6,26.6 27.41,23.8 U6.6
ESP_DP
  Bottom/Vert 0.127: U8.4 23.4,31.5 24.3,30.6 24.3,26.54 26.14,24.7 U6.5
ESP_I34/RADIO_INT  (via drill 0.2)
  Top/Horz 0.127: J10.7 v29.25,36.45 v29.25,36.46 | U5.6 28.09,14.12 v28.64,13.57
  3.3V/Vert 0.127: v29.25,36.46 29.25,24.14 29.16,24.04 29.16,14.09 v28.64,13.57
ESP_I35/DEVICE_SENSE  (via drill 0.2)
  Top/Horz 0.127: v4.5,14.4 4.5,12.5 4.15,12.15 R34.1 R33.2 | U5.7 23.89,15.39 23.7,15.2 v23.7,14.44
  GND/Horz 0.127: v4.5,14.4 12.1,14.4 13.04,15.34 22.8,15.34 v23.7,14.44
ESP_I36/RADIO_RTSO  (via drill 0.2)
  Top/Horz 0.127: J10.9 28.25,36.41 v28.3,36.46 | v28.5,11.8 28.27,11.56 26.93,11.56 26.92,11.58 U5.4
  3.3V/Vert 0.127: v28.3,36.46 28.3,30.98 27.96,30.64 27.96,29.16 28.3,28.82 28.3,12 v28.5,11.8
ESP_I39/ADC39  (via drill 0.2)
  Top/Horz 0.127: U1.4 18.14,30.66 18.3,30.5 v20.2,30.5 | U5.5 23.55,12.85 v22.7,12
  GND/Horz 0.127: v22.7,12 v18.11,12 v18.1,11.99
  3.3V/Vert 0.127: v20.2,30.5 18.8,30.5 18.1,29.8 v18.1,11.99
EXTERNAL_SERIAL1_RXI  (via drill 0.2)
  Top/Horz 0.127: J18.1 23.25,34.45 23.7,34 v24.2,34 | U1.3 19.61,34 v20,34
  GND/Horz 0.127: v20,34 v24.2,34
EXTERNAL_SERIAL1_TXO  (via drill 0.2)
  Top/Horz 0.127: U1.13 18.14,29.34 18.45,29.65 v20.2,29.65 | J18.2 22.75,30.25 v22.5,30
  GND/Horz 0.127: v20.2,29.65 20.27,29.72 22.3,29.72 22.5,29.92 v22.5,30
FENCE_LV
  Top/Horz 0.127: R40.1 31.7,30 32,29.7 32,27.8 32.6,27.2 U3.19
GND  (via drill 0.2)
  Top/Horz 0.178: U1.6 15.6,31.09 v15.5,31
  Bottom/Vert 0.127: U10.5 34.5,3.6 34.9,4 v35.5,4 | U7.6 38.75,13.25 U7.9 | 3.59,6.87 3.56,6.84 R30.1 | R6.1 30.54,7.5 J14.2 | R10.1 2.85,0.95 2.4,1.4 2.4,7.1
  Bottom/Vert 0.305: U8.11 18,29.76 17.76,30 v16.5,30
  other vias: 8.5,31 10.5,28.1 15.5,30 16.5,31 12.4,33.8 12.4,34.4 8.8,36.4 11.5,39.4 19.6,38.7 23.3,37.3 26.8,33 25.3,31.8 28.3,30 21.7,27.2 7.5,29 3,35.3 4.8,34.6 6.4,7.5 9.6,7.6 23.5,8 24.1,7.1 28.5,10.4 29.5,16 31.5,16 32.5,11.5 36.5,14.8 38.3,14.8 41.5,12 43.5,12 46.5,12 48.7,9.4 51.5,12 48.5,5 42.5,5 37.5,6 34.4,1 15.1,13.1 15.1,14.9 16.1,14.9 16.2,13 17.5,13.2 19.9,17.1 17.5,17.2 16.2,17.2 15,17.2 31.5,32 47.3,37 47,36.5 48.1,35.5 48.6,35.1 50.5,35.1 51,35.6 51.7,37 51.7,36.3 51.7,37.8 48.5,33.6 50.6,33.6 51.5,33.6 52.5,33.6 53.5,33.6 54.5,33.6 54.5,32.3 46.5,33.6 44.7,33.6 43,33.6 41.5,33.6 39.7,33.6 38.2,33.6 36.5,33.6 35.2,33.6 33.5,33.6 32.2,33.6 32.3,32.4 32.4,31.5 32.4,30.4 32.4,29.3 32.4,28.5 32.5,17.7 32.7,16.7 34,16.4 35.5,16.4 36.5,16.3 37.5,16.3 38.5,16.3 39.5,16.3 40.5,16.3 44.4,16.4 46,16.4 50.6,16.4 51.5,16.5 52.5,16.5 53.5,16.5 54.5,16.5 54.5,17.4 49.8,19.8 47.7,19.8 45.6,19.8 43.5,19.8 41.4,19.8 39.3,19.8 37.2,19.8 35,19.8 52,19.8 49.8,30.7 47.7,30.7 45.6,30.7 43.5,30.7 41.4,30.7 39.3,30.7 37.2,30.7 35,30.7 52,30.7 49.8,29.8 47.7,29.8 45.6,29.8 43.5,29.8 41.4,29.8 39.3,29.8 37.2,29.8 35,29.8 52,29.8 49.8,28.8 47.7,28.8 45.6,28.8 43.5,28.8 41.4,28.8 39.3,28.8 37.2,28.8 35,28.8 52,28.8 49.8,27.8 47.7,27.8 45.6,27.8 43.5,27.8 41.4,27.8 39.3,27.8 37.2,27.8 35,27.8 52,27.8 49.8,26.8 47.7,26.8 45.6,26.8 43.5,26.8 41.4,26.8 39.3,26.8 37.2,26.8 35,26.8 52,26.8 49.8,25.8 47.7,25.8 45.6,25.8 43.5,25.8 41.4,25.8 39.3,25.8 37.2,25.8 35,25.8 52,25.8 49.8,24.8 47.7,24.8 45.6,24.8 43.5,24.8 41.4,24.8 39.3,24.8 37.2,24.8 35,24.8 52,24.8 49.8,23.8 47.7,23.8 45.6,23.8 43.5,23.8 41.4,23.8 39.3,23.8 37.2,23.8 35,23.8 52,23.8 49.8,22.8 47.7,22.8 45.6,22.8 43.5,22.8 41.4,22.8 39.3,22.8 37.2,22.8 35,22.8 52,22.8 49.8,21.8 47.7,21.8 45.6,21.8 43.5,21.8 41.4,21.8 39.3,21.8 37.2,21.8 35,21.8 52,21.8 49.8,20.8 47.7,20.8 45.6,20.8 43.5,20.8 41.4,20.8 39.3,20.8 37.2,20.8 35,20.8 52,20.8 49.8,18.8 47.7,18.8 45.6,18.8 43.5,18.8 41.4,18.8 39.3,18.8 37.2,18.8 35,18.8 52,18.8 49.8,31.3 47.7,31.3 45.6,31.3 43.5,31.3 41.4,31.3 39.3,31.3 37.2,31.3 35,31.3 52,31.3 34,17.4 35.5,17.4 51.5,17.5 52.5,17.5 53.5,17.5 35,32.8 34,32.8 33,32.8 52,32.8 53,32.8 54,32.8 46,37.6 44.5,37.6 42.7,37.6 44.5,35.6 45,36.6 43.5,36.6 43,35.6 42,34.6 40.5,34.6 46,35.6 54.5,34.6 52.7,34.6 51.2,34.6 57,37.6 54.5,37.6 53.7,37.6 52.2,37.6 54.5,36.6 52.7,36.6 54,35.6 52.5,35.6 57,35.6 38.5,11.8 34.5,4 36.5,4 33.5,4 33.5,3 33.5,2.4 47.3,37.7 47.3,38.4 48,38.4 48.6,38.4 50.5,38.4 51.1,38.5 51.9,38.4 33.5,35 32.1,34.8 42,36.6 17,39
  pour Top/Horz (isolate 0.152, rank 4): 0,41 59,41 59,0 0,0
  pour Bottom/Vert (isolate 0.152, rank 4): 0,41 59,41 59,0 0,0
  pour GND/Horz (isolate 0.152, rank 4): 0,41 59,41 59,0 0,0
  cutout Top/Horz (isolate 0.305): 0,6.5 32.5,6.5 32.5,0 0,0
  cutout GND/Horz (isolate 0.305): 0,6.5 32.5,6.5 32.5,0 0,0
  cutout Bottom/Vert (isolate 0.305): 0,6.5 32.5,6.5 32.5,0 0,0
  cutout 3.3V/Vert (isolate 0.305): 0,6.5 32.5,6.5 32.5,0 0,0
  cutout Top/Horz (isolate 0.305): 48.5,38 50.5,38 50.5,36 48.5,36
GPS_ANT1
  Top/Horz 0.33: U3.2 49.55,34.35 | FB1.1 J2.FEED
  Top/Horz 0.35: 49.55,34.35 FB1.1
LIPO_RAW
  Bottom/Vert 0.127: MEAS2.1 MEAS2.3
  Bottom/Vert 0.559: J7.2 38.77,11 MEAS2.3
N$1
  Bottom/Vert 0.127: R8.1 33.4,9 35.5,6.9 U10.8
N$2
  Top/Horz 0.127: R11.1 3.53,26.85 D1.A
N$3
  Bottom/Vert 0.127: R7.2 19.39,8.96 19.62,9.19 JP7.3
N$4
  Bottom/Vert 0.127: JP7.1 19.54,10.81 R12.2
N$5
  Top/Horz 0.127: U3.51 54.3,28.3 54.9,28.9 54.9,30.45 R2.1
N$6  (via drill 0.2)
  Top/Horz 0.178: v4.6,29 4.6,32 | 4.6,32 4.6,32.73 v4.87,33.01 | v8.5,32 4.6,32
  Bottom/Vert 0.178: C23.2 C22.1 4.03,33.85 v4.87,33.01 | v8.5,32 R26.1 7.35,31.1 Q3.G2 | Q3.D1 4.55,28.95 v4.6,29
N$7
  Bottom/Vert 0.127: C9.2 17.9,37.85 17.75,38 Y1.3 16.35,37.83 R13.2 17,36.15 U8.33
N$8
  Bottom/Vert 0.127: U8.32 16.5,35.5 16.1,35.9 15.5,35.9 14.6,36.8 R13.1 14,36.8 13.9,36.9 13.9,37.2 | 13.9,37.2 13.9,38.8 14.1,39 Y1.1 | C19.2 13.15,37.2 13.9,37.2
N$9
  Bottom/Vert 0.127: U8.35 18,35.3 18.8,36.1 21.5,36.1 22.5,37.1 R5.1
N$10
  Bottom/Vert 0.127: U8.28 14.5,34.3 14.2,34.6 13.9,34.6 12.3,36.2 12.3,37.55 R16.2
N$11
  Top/Horz 0.127: U3.40 49.55,15.8 R27.2
N$12
  Top/Horz 0.127: U3.39 48.5,17.5 R28.2
N$13
  Top/Horz 0.305: 44.05,34.3 R14.2
  Top/Horz 0.33: U3.7 44.05,34.3
N$14
  Bottom/Vert 0.127: U8.25 12.7,32 12.1,31.4 12.1,30.2 11.4,29.5 R17.2
N$15
  Bottom/Vert 0.127: C21.1 19.45,37.16 17.5,35.2 U8.34
N$16
  Top/Horz 0.127: U3.49 55.75,26.1 R1.1
N$17
  Bottom/Vert 0.127: U8.14 16.5,26.15 C24.1
N$18
  Top/Horz 0.127: U3.50 54.4,27.2 55.35,28.15 R42.1
N$19  (via drill 0.2)
  GND/Horz 0.127: v15.5,34.8 15.54,34.84 18.84,34.84 19.28,34.4 v24.5,34.4
  Bottom/Vert 0.127: v24.5,34.4 24.64,34.26 24.64,33.86 24.28,33.5 R25.2 | v15.5,34.8 U8.30
N$20  (via drill 0.2)
  GND/Horz 0.127: v24.3,35.1 23.88,35.1 23.74,35.24 16.04,35.24 v16,35.2
  Bottom/Vert 0.127: R32.2 v24.3,35.1 | v16,35.2 U8.31
N$21  (via drill 0.2)
  Top/Horz 0.127: v13,30.4 JP1.2
  Bottom/Vert 0.127: U8.22 13.1,30.5 v13,30.4
N$22
  Top/Horz 0.127: U3.46 55.95,22.8 R35.1
N$23  (via drill 0.2)
  Top/Horz 0.127: v13,31.6 12.4,31.6 10.59,33.41 JP2.2
  Bottom/Vert 0.127: U8.24 13.1,31.5 v13,31.6
N$24
  Bottom/Vert 0.127: Q2.5 22.5,14.4 22.8,14.1 24.75,14.1 R23.2
N$25
  Bottom/Vert 0.127: R29.2 21.15,13.8 22.4,13.8 22.5,13.7 Q2.2
POWER_BTN  (via drill 0.2)
  Top/Horz 0.127: J8.2 40.75,37.95 v40.8,38
  Top/Horz 0.178: v8.8,34 3.3,34 2.9,33.6 v2.9,31
  GND/Horz 0.127: v2.6,37.5 16.48,37.5 16.93,37.95 26.54,37.95 26.56,37.93 40.7,37.93 40.77,38 v40.8,38
  3.3V/Vert 0.127: v2.6,37.5 2.6,31.3 v2.9,31
  Bottom/Vert 0.127: C23.1 2.95,37.85 v2.6,37.5
  Bottom/Vert 0.178: v2.9,31 D4.C | R31.1 v8.8,34
PPS
  Top/Horz 0.127: U3.53 54.5,30.5 55,31 55,34.15 R41.1
PROG1
  Bottom/Vert 0.127: U10.6 34.5,7.2 34.2,7.5 R6.2
RTK_LV
  Top/Horz 0.127: R39.1 31.4,28 32.1,27.3 32.1,26.2 32.2,26.1 U3.20
RX2_LV
  Top/Horz 0.127: U3.26 32.3,19.5 32.2,19.6 32.2,24.52 32.34,24.66 32.34,25.46 31.8,26 R38.1
RXLV
  Top/Horz 0.127: U3.43 54.2,19.5 54.84,18.86 54.84,16.24 54.5,15.9 R36.1
SCL_LV
  Top/Horz 0.127: U3.45 54.4,21.7 55.2,20.9 55.2,20.45 56,19.65 R9.1
SDA_LV
  Top/Horz 0.127: U3.44 54.6,20.6 55.1,20.1 55.1,15.75 R4.1
TX2_LV
  Top/Horz 0.127: U3.27 32.3,18.4 31.9,18.8 31.9,23.5 31.4,24 R37.1
TXLV
  Top/Horz 0.127: U3.42 53.15,18.4 52.9,18.15 52.9,15.25 R3.1
USB_!RESET
  Bottom/Vert 0.127: U8.26 R18.1 C28.1
USB_DM  (via drill 0.2)
  Top/Horz 0.127: J18.8 19.75,35.15 v19.5,34.9
  Bottom/Vert 0.127: v19.5,34.9 19.5,33.8 19.8,33.5 R25.1
USB_DP  (via drill 0.2)
  Top/Horz 0.127: v20.04,34.86 20.25,35.07 J18.7
  Bottom/Vert 0.127: v20.04,34.86 20.28,35.1 R32.1
V_BATT  (via drill 0.2)
  Top/Horz 0.305: U4.1 50.7,9.05 | 50.7,9.05 51.4,9.05 C17.1 | U4.3 50.55,10.95 50.7,10.8 50.7,9.05
  Top/Horz 0.559: U4.1 49.8,7.9 49.4,7.5 36.2,7.5 35.23,8.47 MEAS2.4
  GND/Horz 0.305: v5.1,12 17.5,12 17.93,12.43 32.8,12.43 MEAS2.4
  3.3V/Vert 0.305: v5.1,12 5.18,12.08 5.18,20.22 5.9,20.94 5.9,37.5 v6.5,38.1
  Bottom/Vert 0.305: D7.A 5.65,38.1 v6.5,38.1 | 35.5,12 C15.1 35.55,12.1 36.3,12.1 36.5,12.3 36.5,12.7 | MEAS2.2 MEAS2.4 | U7.3 36.65,13.25 36.5,13.1 36.5,12.7 | 36.5,12.7 36.55,12.75 U7.2 | U10.9 36,7.35 C3.1 36.5,7.75 U10.10
  Bottom/Vert 0.559: 35.5,12 35.5,10.27 MEAS2.4 35.23,8.17 35.6,7.8 C3.1
V_RAW  (via drill 0.2)
  GND/Horz 0.305: v7.2,6.5 25.1,6.5 26.8,8.2 33,8.2 37.5,3.7 v37.5,1
  3.3V/Vert 0.305: v7.2,6.5 7.2,15.69 7.43,15.92 7.43,22.68 6.5,23.61 v6.5,33
  Bottom/Vert 0.305: Q3.S2 5.5,31 5.65,31.15 R26.2 | R26.2 5.65,33 | 5.65,33 R31.2 5.65,35.8 D7.C D2.C | C22.2 5.5,32.15 R26.2 | 5.65,33 v6.5,33 | C16.1 38.5,1.3 38.2,1 v37.5,1 36.5,1 | 36.5,1 36.1,1 36,1.1 U10.2 | U10.1 36.5,1
V_USB  (via drill 0.2)
  Top/Horz 0.305: J15.1 14.25,37.85 14.1,38 13.7,38 | 13.7,38 13.2,38 | 13.2,38 12.8,38 12.75,37.95 | J15.2 13.75,37.95 13.7,38 | J15.3 13.25,37.95 13.2,38 | J15.4 12.75,37.95 | v35.8,34.9 35.75,34.95 J8.12 | 12.75,37.95 12.62,37.95 v12.3,38.27
  GND/Horz 0.305: v35.8,38.3 35.77,38.27 v12.3,38.27 8.67,38.27 v8.4,38
  3.3V/Vert 0.305: v35.8,38.3 v35.8,34.9
  Bottom/Vert 0.305: D2.A 7.65,38 v8.4,38 8.25,37.85 8.25,35.2 9.44,34 R21.2
VBUS_DET
  Bottom/Vert 0.127: U8.27 12.35,33 R21.1 R19.2 C29.1
VOUT  (via drill 0.2)
  Top/Horz 0.305: J10.12 26.75,34.05 26.37,33.67 26.37,26.09 v26.46,26 | J15.9 10.25,37.3 | 10.25,37.3 10.25,39.45 v10.2,39.5 | 11.3,37.3 11.5,37.3 11.75,37.05 J15.6 | J15.7 11.25,37.25 11.3,37.3 | 11.3,37.3 10.8,37.3 | 10.8,37.3 10.25,37.3 | J15.8 10.75,37.25 10.8,37.3
  GND/Horz 0.305: v32,25.1 32,25.5 31.5,26 v26.46,26 v10.06,26 v7.5,26
  3.3V/Vert 0.305: v10.2,39.5 v10.19,39.5 10.07,39.38 10.07,26.01 v10.06,26
  Bottom/Vert 0.305: Q3.D2 6.45,26.1 C20.1 | C20.1 R22.2 | U2.1 31.55,13.95 31.8,14.2 33.45,14.2 | U2.3 33.45,14.2 | 33.45,14.2 33.45,14.9 C6.1 33.3,15 31.48,16.82 31.48,25.1 | U12.1 31.05,28.7 31.48,29.12 | 31.48,29.12 C27.1 | 31.48,25.1 31.48,29.12 | C20.1 v7.5,26 | v32,25.1 31.48,25.1
ZED-RXI2  (via drill 0.2)
  Top/Horz 0.127: J18.9 19.25,38.95 19.4,39.1 v29.9,39.1 | R38.2 29.15,26.6 29.35,26.8 v30.05,26.8
  3.3V/Vert 0.127: v30.05,26.8 30.36,27.11 30.36,32.63 30.17,32.82 30.17,38.9 29.97,39.1 v29.9,39.1
ZED-TXO2  (via drill 0.2)
  Top/Horz 0.127: J18.10 18.75,39.02 19.21,39.48 30.22,39.48 v30.4,39.3 | R37.2 29.95,24.8 v30.48,24.8
  3.3V/Vert 0.127: v30.48,24.8 30.59,24.91 30.59,32.73 30.4,32.92 v30.4,39.3
ZED_BACKUP
  Top/Horz 0.127: U3.36 45.15,12.35 45.5,12 C18.1 46.3,10.05 46.3,9.2 46.45,9.05 U4.5
ZED_DM  (via drill 0.2)
  Top/Horz 0.127: v48.5,12.1 R28.1
  GND/Horz 0.127: v26.7,10.4 26.7,10.3 27.3,9.7 33,9.7 34.3,8.4 46.5,8.4 48.5,10.4 v48.5,12.1
  3.3V/Vert 0.127: v25.7,32.9 25.8,32.9 26.06,32.64 26.06,11.04 v26.7,10.4
  Bottom/Vert 0.127: U8.1 19.87,33 20.14,32.73 25.53,32.73 v25.7,32.9
ZED_DP  (via drill 0.2)
  Top/Horz 0.127: R27.1 v50.5,12
  GND/Horz 0.127: v26.6,9.7 26.84,9.46 32.92,9.46 34.2,8.17 46.67,8.17 v50.5,12
  3.3V/Vert 0.127: v25.7,32.11 25.73,32.08 25.73,10.33 26.36,9.7 v26.6,9.7
  Bottom/Vert 0.127: U8.2 25.31,32.5 v25.7,32.11
ZED_EXTINT  (via drill 0.2)
  Top/Horz 0.127: U1.5 16.86,36.53 16.2,37.2 v16.2,39.7 | R2.2 56.15,33.4 v56.8,33.4
  GND/Horz 0.127: v16.2,39.7 16.22,39.68 57.32,39.68 v57.4,39.6
  3.3V/Vert 0.127: v57.4,39.6 57.38,39.6 57.34,39.56 57.34,35.46 57.34,33.94 v56.8,33.4
ZED_PPS_STAT  (via drill 0.2)
  Top/Horz 0.127: U1.14 19.41,28.91 19.7,29.2 v20.7,29.2 | R41.2 56,39.87 v56.5,40.37
  GND/Horz 0.127: v56.5,40.37 56.43,40.3 v20.7,40.3
  3.3V/Vert 0.127: v20.7,29.2 v20.7,40.3 | J4.2 58.6,12.26 58.6,39.3 57.53,40.37 v56.5,40.37

## Text on the board
Top/Horz: v13
Dimension: Route Out
bPlace: + | -
tDocu: Board thickness is 1.6mm | 4 Layer Board | No clean process | Finish: ENIG | Soldermask: Red | Stackup: JLC7628 Impedence Controlled | Material: TG155 | N. Seidle